# Altium schematic sheet Sheet_Business_Card.SchDoc
size A4
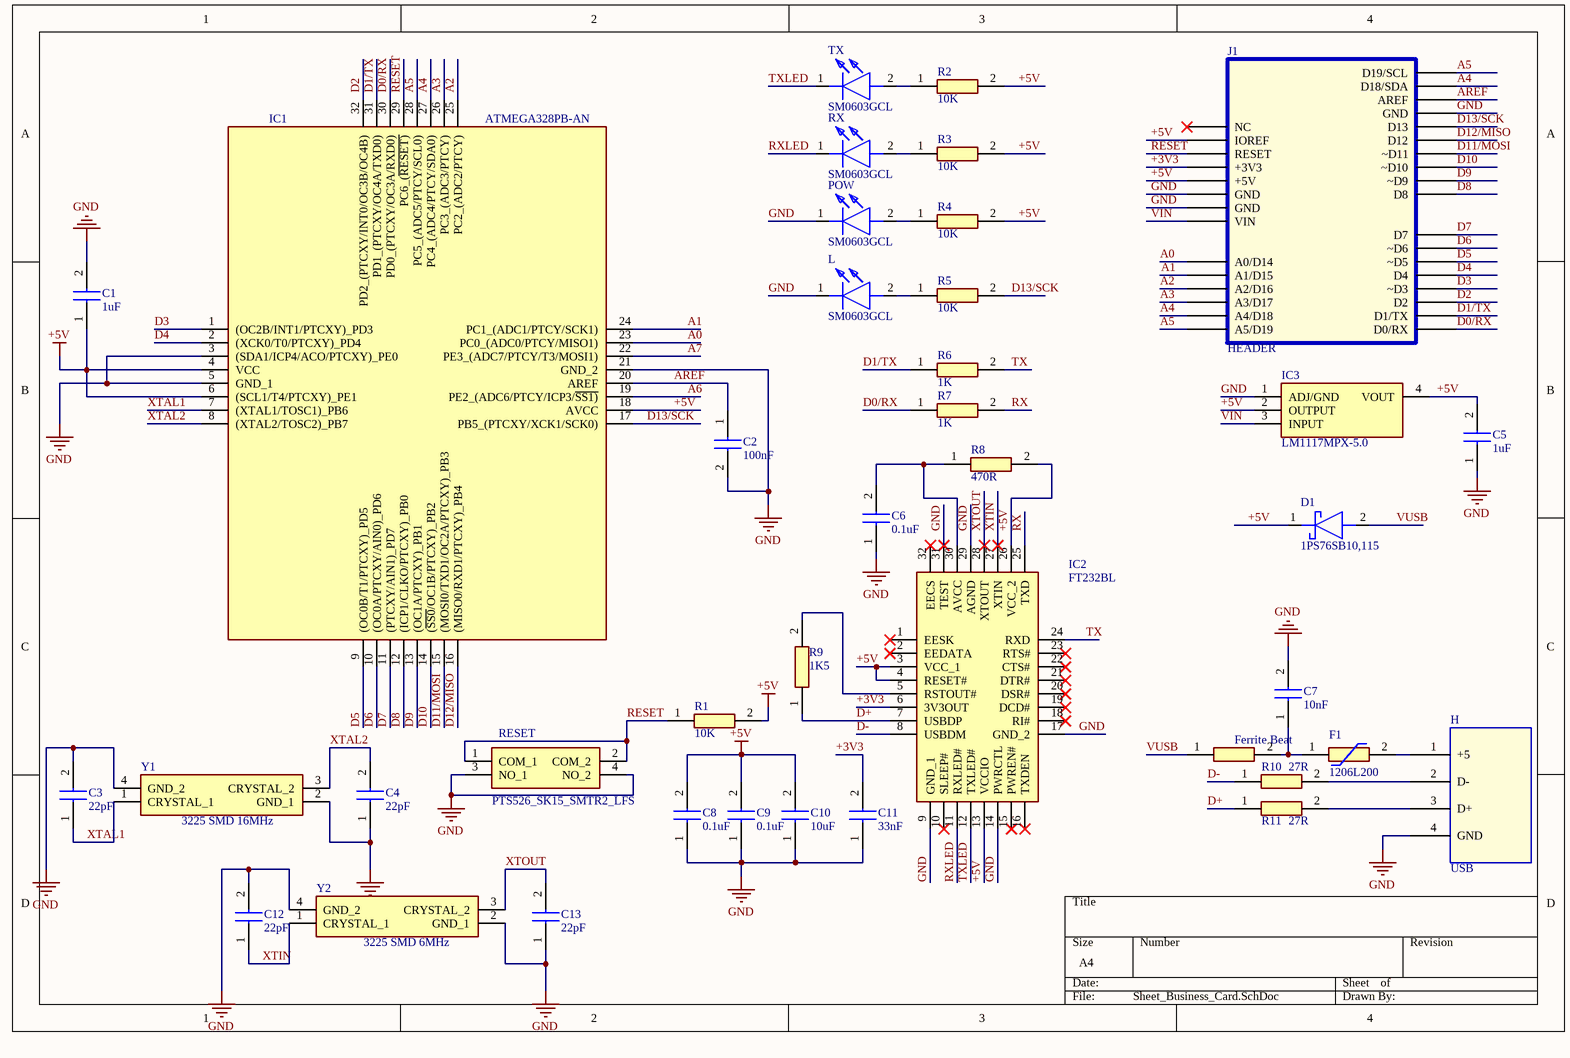
[diagram p0: Sheet_Business_Card.SchDoc]

## Parts
C1  1uF  [CAPC1608X90N]
C2  100nF  [CAPC1608X90N]
C3  22pF  [CAPC1608X90N]
C4  22pF  [CAPC1608X90N]
C5  1uF  [CAPC1608X90N]
C6  0.1uF  [CAPC1608X90N]
C7  10nF  [CAPC1608X90N]
C8  0.1uF  [CAPC1608X90N]
C9  0.1uF  [CAPC1608X90N]
C10  10uF  [CAPC1608X90N]
C11  33nF  [CAPC1608X90N]
C12  22pF  [CAPC1608X90N]
C13  22pF  [CAPC1608X90N]
D1  1PS76SB10,115  [SOD2512X110N]
F1  1206L200  [1206L05015YR]
FB  Ferrite Beat  [RESC1608X55N]
H  USB  [USB_FLAT]
IC1  ATMEGA328PB-AN  [QFP80P900X900X120-32N]
IC2  FT232BL  [QFP80P900X900X160-32N]
IC3  LM1117MPX-5.0  [SOT230P700X180-4N]
J1  HEADER  [Conector Arduino UNO]
L  SM0603GCL  [LEDC1608X60N]
POW  SM0603GCL  [LEDC1608X60N]
R1  10K  [RESC1608X55N]
R2  10K  [RESC1608X55N]
R3  10K  [RESC1608X55N]
R4  10K  [RESC1608X55N]
R5  10K  [RESC1608X55N]
R6  1K  [RESC1608X55N]
R7  1K  [RESC1608X55N]
R8  470R  [RESC1608X55N]
R9  1K5  [RESC1608X55N]
R10  27R  [RESC1608X55N]
R11  27R  [RESC1608X55N]
RESET  PTS526_SK15_SMTR2_LFS  [PTS526SK15SMTR2LFS]
RX  SM0603GCL  [LEDC1608X60N]
TX  SM0603GCL  [LEDC1608X60N]
Y1  TSX-3225_16.0000MF18X-AC0  [TSX3225160000MF18XAC0]  (value not drawn)
Y2  TSX-3225_16.0000MF18X-AC0  [TSX3225160000MF18XAC0]  (value not drawn)

## Nets
+5V: C1.1 C5.2 C8.2 C9.2 C10.2 D1.1(K) IC1.4(VCC) IC1.6((SCL1/T4/PTCXY)_PE1) IC1.18(AVCC) IC2.3(VCC_1) IC2.4(RESET#) IC2.13(VCCIO) IC2.26(VCC_2) IC3.2(OUTPUT) IC3.4(VOUT) J1.4(IOREF) R1.2 R2.2 R3.2 R4.2 R8.2
GND: C1.2 C2.2 C3.2 C4.1 C5.1 C6.1 C7.2 C8.1 C9.1 C10.1 C11.1 C12.2 C13.1 H.4(GND) IC1.3((SDA1/ICP4/ACO/PTCXY)_PE0) IC1.5(GND_1) IC1.21(GND_2) IC2.9(GND_1) IC2.14(PWRCTL) IC2.17(GND_2) IC2.29(AGND) IC2.31(TEST) IC3.1(ADJ/GND) J1.3(GND) J1.5(GND) J1.21(GND) L.1(K) POW.1(K) RESET.3(NO_1) RESET.4(NO_2) Y1.2(GND_1) Y1.4(GND_2) Y2.2(GND_1) Y2.4(GND_2)
+3V3: C11.2 IC2.6(3V3OUT) J1.6(+3V3)
A0: IC1.23(PC0_(ADC0/PTCY/MISO1)) J1.23(A0/D14)
A1: IC1.24(PC1_(ADC1/PTCY/SCK1)) J1.24(A1/D15)
A2: IC1.25(PC2_(ADC2/PTCY)) J1.25(A2/D16)
A3: IC1.26(PC3_(ADC3/PTCY)) J1.26(A3/D17)
A4: IC1.27(PC4_(ADC4/PTCY/SDA0)) J1.27(A4/D18)
A5: IC1.28(PC5_(ADC5/PTCY/SCL0)) J1.28(A5/D19)
A6: IC1.19(PE2_(ADC6/PTCY/ICP3/~{SS1)})
A7: IC1.22(PE3_(ADC7/PTCY/T3/MOSI1))
AREF: C2.1 IC1.20(AREF) J1.20(AREF)
D0/RX: IC1.30(PD0_(PTCXY/OC3A/RXD0)) J1.30(D0/RX) R7.1
D1/TX: IC1.31(PD1_(PTCXY/OC4A/TXD0)) J1.31(D1/TX) R6.1
D2: IC1.32(PD2_(PTCXY/INT0/OC3B/OC4B)) J1.32(D2)
D3: IC1.1((OC2B/INT1/PTCXY)_PD3) J1.1(~D3)
D4: IC1.2((XCK0/T0/PTCXY)_PD4) J1.2(D4)
D5: IC1.9((OC0B/T1/PTCXY)_PD5) J1.9(~D5)
D6: IC1.10((OC0A/PTCXY/AIN0)_PD6) J1.10(~D6)
D7: IC1.11((PTCXY/AIN1)_PD7) J1.11(D7)
D8: IC1.12((ICP1/CLKO/PTCXY)_PB0) J1.12(D8)
D9: IC1.13((OC1A/PTCXY)_PB1) J1.13(~D9)
D10: IC1.14((~{SS0}/OC1B/PTCXY)_PB2) J1.14(~D10)
D11/MOSI: IC1.15((MOSI0/TXD1/OC2A/PTCXY)_PB3) J1.15(~D11)
D12/MISO: IC1.16((MISO0/RXD1/PTCXY)_PB4) J1.16(D12)
D13/SCK: IC1.17(PB5_(PTCXY/XCK1/SCK0)) J1.17(D13) R5.2
D+: IC2.7(USBDP) R9.1 R11.1
D-: IC2.8(USBDM) R10.1
RESET: IC1.29(PC6_(~{RESET)}) J1.29(RESET) R1.1 RESET.1(COM_1) RESET.2(COM_2)
RX: IC2.25(TXD) R7.2
RXLED: IC2.11(RXLED#) RX.1(K)
TX: IC2.24(RXD) R6.2
TXLED: IC2.12(TXLED#) TX.1(K)
VIN: IC3.3(INPUT) J1.33(VIN)
VUSB: D1.2(A) FB.1
XTAL1: C3.1 IC1.7((XTAL1/TOSC1)_PB6) Y1.1(CRYSTAL_1)
XTAL2: C4.2 IC1.8((XTAL2/TOSC2)_PB7) Y1.3(CRYSTAL_2)
XTIN: C12.1 IC2.27(XTIN) Y2.1(CRYSTAL_1)
XTOUT: C13.2 IC2.28(XTOUT) Y2.3(CRYSTAL_2)
NetC6_2: C6.2 IC2.30(AVCC) R8.1
NetC7_1: C7.1 F1.1 FB.2
NetF1_2: F1.2 H.1(+5)
NetH_2: H.2(D-) R10.2
NetH_3: H.3(D+) R11.2
NetIC2_5: IC2.5(RSTOUT#) R9.2
NetL_2: L.2(A) R5.1
NetPOW_2: POW.2(A) R4.1
NetR2_1: R2.1 TX.2(A)
NetR3_1: R3.1 RX.2(A)

Not connected (* = marked no-connect by the designer): IC2 1(EESK)* 2(EEDATA)* 10(SLEEP#)* 15(PWREN#)* 16(TXDEN)* 18(RI#)* 19(DCD#)* 20(DSR#)* 21(DTR#)* 22(CTS#)* 23(RTS#)* 32(EECS)*; J1 ?1(NC)*

## Notes on the sheet
- (near Y1) 3225 SMD 16MHz
- (near Y2) 3225 SMD 6MHz

## Library data of the parts
C1-C13 = 06035C105KAT2A: Capacitor; Manufacturer_Name: Kyocera AVX; Datasheet Link: https://componentsearchengine.com/Datasheets/1/06031A100FAT2A.pdf; Height: 0.9mm; Manufacturer_Part_Number: 06035C105KAT2A; Mouser Part Number: 581-06035C105KAT2A; Mouser Price/Stock: https://www.mouser.co.uk/ProductDetail/KYOCERA-AVX/06035C105KAT2A?qs=%252BdQmOuGyFcGCdIIWh6fU7Q%3D%3D; Arrow Part Number: 06035C105KAT2A; Arrow Price/Stock: https://www.arrow.com/en/products/06035c105kat2a/avx?region=nac
D1 = 1PS76SB10,115: Schottky Diode; Manufacturer_Name: Nexperia; Datasheet Link: https://assets.nexperia.com/documents/data-sheet/1PS76SB10.pdf; Height: 1.1mm; Manufacturer_Part_Number: 1PS76SB10,115; Mouser Part Number: 771-1PS76SB10-T/R; Mouser Price/Stock: https://www.mouser.co.uk/ProductDetail/Nexperia/1PS76SB10115?qs=P62ublwmbi%252BteaMAe9dhAQ%3D%3D; Arrow Part Number: 1PS76SB10,115; Arrow Price/Stock: https://www.arrow.com/en/products/1ps76sb10115/nexperia?region=europe
F1 = 1206L200: Resettable Fuse; Manufacturer_Name: LITTELFUSE; Datasheet Link: https://m.littelfuse.com/~/media/electronics/datasheets/resettable_ptcs/littelfuse_ptc_1206l_datasheet.pdf.pdf; Height: 0.75mm; Manufacturer_Part_Number: 1206L200
FB R1-R11 = KTR03EZPF1501: Resistor; Manufacturer_Name: ROHM Semiconductor; Datasheet Link: http://rohmfs.rohm.com/en/products/databook/datasheet/passive/resistor/chip_resistor/ktr.pdf; Height: 0.55mm; Manufacturer_Part_Number: KTR03EZPF1501; Mouser Part Number: 755-KTR03EZPF1501; Mouser Price/Stock: https://www.mouser.com/Search/Refine.aspx?Keyword=755-KTR03EZPF1501
IC1 = ATMEGA328PB-AN: Integrated Circuit; Manufacturer_Name: Microchip; Datasheet Link: http://ww1.microchip.com/downloads/en/DeviceDoc/40001906C.pdf; Height: 1.2mm; Manufacturer_Part_Number: ATMEGA328PB-AN; Mouser Part Number: 556-ATMEGA328PB-AN; Mouser Price/Stock: https://www.mouser.co.uk/ProductDetail/Microchip-Technology/ATMEGA328PB-AN?qs=jy4bLUHv09gDoS2J01KCIw%3D%3D; Arrow Part Number: ATMEGA328PB-AN; Arrow Price/Stock: https://www.arrow.com/en/products/atmega328pb-an/microchip-technology?region=nac
IC2 = FT232BL: Integrated Circuit; Manufacturer_Name: FTDI Chip; Datasheet Link: https://datasheet.datasheetarchive.com/originals/distributors/Datasheets-12/DSA-234929.pdf; Height: 1.6mm; Manufacturer_Part_Number: FT232BL
IC3 = LM1117MPX-5.0: Integrated Circuit; Manufacturer_Name: Texas Instruments; Datasheet Link: http://www.ti.com/lit/ds/symlink/lm1117.pdf; Height: 1.8mm; Manufacturer_Part_Number: LM1117MPX-5.0; Mouser Part Number: 926-LM1117MPX-50; Mouser Price/Stock: https://www.mouser.co.uk/ProductDetail/Texas-Instruments/LM1117MPX-5.0?qs=X1J7HmVL2ZHoM1M62jeGVQ%3D%3D; Arrow Part Number: LM1117MPX-5.0; Arrow Price/Stock: https://www.arrow.com/en/products/lm1117mpx-5.0/texas-instruments?region=nac
J1 = HEDER ARDUINO UNO
L POW RX TX = SM0603GCL: LED; Manufacturer_Name: Bivar; Datasheet Link: https://www.arrow.com/en/products/sm0603gcl/bivar; Height: 0.6mm; Manufacturer_Part_Number: SM0603GCL; Mouser Part Number: 749-SM0603GCL; Mouser Price/Stock: https://www.mouser.co.uk/ProductDetail/Bivar/SM0603GCL?qs=jaLxTFIJCiusAuEoyf5wog%3D%3D; Arrow Part Number: SM0603GCL; Arrow Price/Stock: https://www.arrow.com/en/products/sm0603gcl/bivar?region=nac
RESET = PTS526_SK15_SMTR2_LFS: Switch; Manufacturer_Name: C & K COMPONENTS; Manufacturer_Part_Number: PTS526 SK15 SMTR2 LFS; Datasheet Link: https://www.ckswitches.com/media/2780/pts526.pdf; Height: 1.65mm; Mouser Part Number: 611-PTS526SK15SMR2L; Mouser Price/Stock: https://www.mouser.co.uk/ProductDetail/CK/PTS526-SK15-SMTR2-LFS?qs=UXgszm6BlbF5Ezp94JAQtw%3D%3D; Arrow Part Number: PTS526 SK15 SMTR2 LFS; Arrow Price/Stock: https://www.arrow.com/en/products/pts526-sk15-smtr2-lfs/ck?utm_currency=USD&region=nac
Y1 = TSX-3225_16.0000MF18X-AC0: Crystal or Oscillator 16MHz; Manufacturer_Name: Epson Timing; Manufacturer_Part_Number: TSX-3225 16.0000MF18X-AC0; Datasheet Link: https://support.epson.biz/td/api/doc_check.php?dl=brief_FA-238V_en.pdf; Height: 0.6mm; Mouser Part Number: 732-322516F18XAC0; Mouser Price/Stock: https://www.mouser.co.uk/ProductDetail/Epson-Timing/TSX-3225-16.0000MF18X-AC0?qs=wwacUt%252BV97taurHtFwy%2FEA%3D%3D; Arrow Part Number: TSX-3225 16.0000MF18X-AC0; Arrow Price/Stock: https://www.arrow.com/en/products/tsx-322516.0000mf18x-ac0/epson-electronics-america?region=nac
Y2 = TSX-3225_16.0000MF18X-AC0: Crystal or Oscillator 6 MHz; Manufacturer_Name: Epson Timing; Manufacturer_Part_Number: TSX-3225 16.0000MF18X-AC0; Datasheet Link: https://support.epson.biz/td/api/doc_check.php?dl=brief_FA-238V_en.pdf; Height: 0.6mm; Mouser Part Number: 732-322516F18XAC0; Mouser Price/Stock: https://www.mouser.co.uk/ProductDetail/Epson-Timing/TSX-3225-16.0000MF18X-AC0?qs=wwacUt%252BV97taurHtFwy%2FEA%3D%3D; Arrow Part Number: TSX-3225 16.0000MF18X-AC0; Arrow Price/Stock: https://www.arrow.com/en/products/tsx-322516.0000mf18x-ac0/epson-electronics-america?region=nac